# Altium schematic sheet LoadCellAmplifierV2.SchDoc
size A
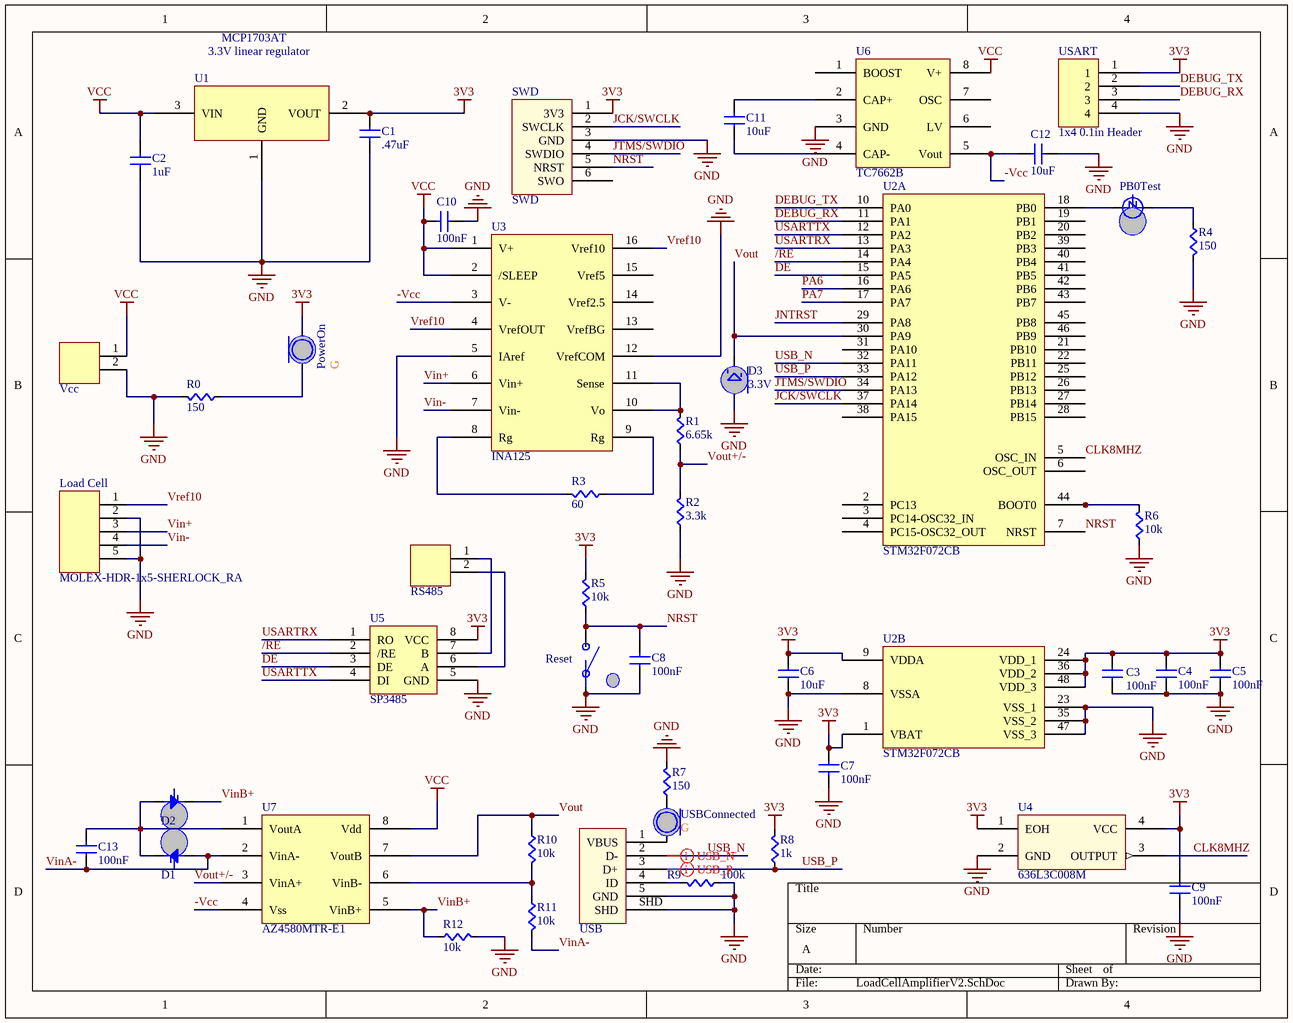
[diagram p0: LoadCellAmplifierV2.SchDoc]

## Parts
C1  value .47uF  [CAPC0603]  (hidden comment: Cap)
C2  value 1uF  [CAPC0603]  (hidden comment: Cap)
C3  value 100nF  [CAPC0603]  (hidden comment: Cap)
C4  value 100nF  [CAPC0603]  (hidden comment: Cap)
C5  value 100nF  [CAPC0603]  (hidden comment: Cap)
C6  value 10uF  [CAPC1206]  (hidden comment: Cap)
C7  value 100nF  [CAPC0603]  (hidden comment: Cap)
C8  value 100nF  [CAPC0603]  (hidden comment: Cap)
C9  value 100nF  [CAPC0603]  (hidden comment: Cap)
C10  value 100nF  [CAPC0603]  (hidden comment: Cap)
C11  value 10uF  [CAPC1206]  (hidden comment: Cap)
C12  value 10uF  [CAPC1206]  (hidden comment: Cap)
C13  value 100nF  [CAPC0603]  (hidden comment: Cap)
D1  Diode  [SOD-323F]  (value not drawn)
D2  Diode  [SOD-323F]  (value not drawn)
D3  Zener Voltage: 3.3V  [LED0603]  (hidden comment: Zener)
Load_Cell  MOLEX-HDR-1x5-SHERLOCK_RA  [MOLEX-HDR-1X5-SHERLOCK- RA]
PB0Test  Color: G  [LED0805]  (hidden comment: LED)
PowerOn  Color: G  [LED0805]  (hidden comment: LED)
R0  value 150  [RES0603]  (hidden comment: Res)
R1  value 6.65k  [RES0603]  (hidden comment: Res)
R2  value 3.3k  [RES0603]  (hidden comment: Res)
R3  value 60  [RES0603]  (hidden comment: Res)
R4  value 150  [RES0603]  (hidden comment: Res)
R5  value 10k  [RES0603]  (hidden comment: Res)
R6  value 10k  [RES0603]  (hidden comment: Res)
R7  value 150  [RES0603]  (hidden comment: Res)
R8  value 1k  [RES0603]  (hidden comment: Res)
R9  value 100k  [RES0603]  (hidden comment: Res)
R10  value 10k  [RES0603]  (hidden comment: Res)
R11  value 10k  [RES0603]  (hidden comment: Res)
R12  value 10k  [RES0603]  (hidden comment: Res)
Reset  Button  [PTS645xxxxSMTR92]  (value not drawn)
RS485  2-pin Horz Sherlock  [MOLEX-HDR-1X2-SHERLOCK-HORZ]  (value not drawn)
SWD  SWD  [SWD_STM32]
U1  MCP1703AT  [MCP1703AT-xx02EDB]
U2  STM32F072CB  [STM32F072CB]  (parts A,B of 2)
U3  INA125  [SOIC127P600X175-16N]
U4  636L3C008M  [636L3C]
U5  SP3485  [SP3485]
U6  TC7662B  [8-SOIC]
U7  AZ4580MTR-E1  [8-SOIC]
USART  1x4 0.1in Header  [1x4 0.1in Header]
USB  USB Micro  [10118192-0001LF]  (value not drawn)
USBConnected  Color: G  [LED0805]  (hidden comment: LED)
Vcc  2-pin Horz Sherlock  [MOLEX-HDR-1X2-SHERLOCK-HORZ]  (value not drawn)

## Nets
3V3: C1.1(A) C3.1(A) C4.1(A) C5.1(A) C6.2(B) C7.1(A) C9.1(A) PowerOn.A R5.1(A) R8.1(A) SWD.1(3V3) U1.2(VOUT) U2.1(VBAT) U2.9(VDDA) U2.24(VDD_1) U2.36(VDD_2) U2.48(VDD_3) U4.1(EOH) U4.4(VCC) U5.8(VCC) USART.1
GND: C1.2(B) C2.2(B) C3.2(B) C4.2(B) C5.2(B) C6.1(A) C7.2(B) C8.2(B) C9.2(B) C10.1(A) C12.1(A) D3.A Load_Cell.2 Load_Cell.5 R0.1(A) R2.2(B) R4.1(A) R6.2(B) R7.1(A) R9.2(B) R12.1(A) Reset.A SWD.3(GND) U1.1(GND) U2.8(VSSA) U2.23(VSS_1) U2.35(VSS_2) U2.47(VSS_3) U3.5(IAref) U3.12(VrefCOM) U4.2(GND) U5.5(GND) U6.3(GND) USART.4 USB.5(GND) USB.SHD Vcc.2
VCC: C2.1(A) C10.2(B) U1.3(VIN) U3.1(V+) U3.2(/SLEEP) U6.8(V+) U7.8(Vdd) Vcc.1
-Vcc: C12.2(B) U3.3(V-) U6.5(Vout) U7.4(Vss)
/RE: U2.14(PA4) U5.2(/RE)
CLK8MHZ: U2.5(OSC_IN) U4.3(OUTPUT)
DE: U2.15(PA5) U5.3(DE)
DEBUG_RX: U2.11(PA1) USART.3
DEBUG_TX: U2.10(PA0) USART.2
JCK/SWCLK: SWD.2(SWCLK) U2.37(PA14)
JNTRST: U2.29(PA8)
JTMS/SWDIO: SWD.4(SWDIO) U2.34(PA13)
NRST: C8.1(A) R5.2(B) Reset.B SWD.5(NRST) U2.7(NRST)
PA6: U2.16(PA6)
PA7: U2.17(PA7)
USARTRX: U2.13(PA3) U5.1(RO)
USARTTX: U2.12(PA2) U5.4(DI)
USB_N: U2.32(PA11) USB.2(D-)
USB_P: R8.2(B) U2.33(PA12) USB.3(D+)
Vin+: Load_Cell.3 U3.6(Vin+)
Vin-: Load_Cell.4 U3.7(Vin-)
VinA-: C13.2(B) D1.A R11.1(A) U7.2(VinA-)
VinB+: D2.C R12.2(B) U7.5(VinB+)
Vout: D3.C R10.2(B) U2.30(PA9) U7.7(VoutB)
Vout+/-: R1.2(B) R2.1(A) U7.3(VinA+)
Vref10: Load_Cell.1 U3.4(VrefOUT) U3.16(Vref10)
NetC11_1: C11.1(A) U6.4(CAP-)
NetC11_2: C11.2(B) U6.2(CAP+)
NetC13_1: C13.1(A) D1.C D2.A U7.1(VoutA)
NetPB0Test_A: PB0Test.A U2.18(PB0)
NetPB0Test_C: PB0Test.C R4.2(B)
NetPowerOn_C: PowerOn.C R0.2(B)
NetR1_1: R1.1(A) U3.10(Vo) U3.11(Sense)
NetR3_1: R3.1(A) U3.8(Rg)
NetR3_2: R3.2(B) U3.9(Rg)
NetR6_1: R6.1(A) U2.44(BOOT0)
NetR7_2: R7.2(B) USBConnected.C
NetR9_1: R9.1(A) USB.4(ID)
NetR10_1: R10.1(A) R11.2(B) U7.6(VinB-)
NetRS485_1: RS485.1 U5.7(B)
NetRS485_2: RS485.2 U5.6(A)
NetUSB_1: USB.1(VBUS) USBConnected.A

Not connected (* = marked no-connect by the designer): SWD 6(SWO); U2 2(PC13) 3(PC14-OSC32_IN) 4(PC15-OSC32_OUT) 6(OSC_OUT) 19(PB1) 20(PB2) 21(PB10) 22(PB11) 25(PB12) 26(PB13) 27(PB14) 28(PB15) 31(PA10) 38(PA15) 39(PB3) 40(PB4) 41(PB5) 42(PB6) 43(PB7) 45(PB8) 46(PB9); U3 13(VrefBG) 14(Vref2.5) 15(Vref5); U6 1(BOOST) 6(LV) 7(OSC)

## Layout directives
differential pair: USB_N, USB_P

## Notes on the sheet
- 3.3V linear regulator

## Library data of the parts
D1 D2 = Diode: Standard Diode Template; Supplier 1: Digi-Key; Supplier Part Number 1: DB2J20900LCT-ND
D3 = Zener: Zener Diode; Supplier 1: Digi-Key; Supplier Part Number 1: CD0603-Z3V3CT-ND
Load_Cell = MOLEX-HDR-1x5-SHERLOCK_RA: Header, Molex, 2mm Pitch Sherlock Header, Single Row, Vertical, 5 Circuits, Length 3.3mm, 0353620550; Manufacturer Part Number: 0353630560; Supplier Part Number 1: WM18934-ND; Supplier 1: Digikey; Manufacturer: Molex
Reset = Button: SPST Button; Supplier 1: Digi-Key; Supplier Part Number 1: CKN9087CT-ND
RS485 Vcc = MOLEX-HDR-1x2-SHERLOCK_RA: Header, Molex, 2mm Pitch Sherlock Header, Single Row, Horizontal, 2 Circuits, Length 3.3mm,  0353630260; Manufacturer: Molex Inc; Manufacturer Part Number: 0353630260
  RS485: Supplier Part Number: WM18931-ND; Supplier: Digi-Key
  Vcc: Supplier Part Number 1: WM18931-ND; Supplier 1: Digi-Key
SWD = SWD_STM32: SWD connector matching the pinout on STM Discovery Boards
U1 = MCP1703AT: 250 mA, 16V, Low Quiescent Current LDO Regulator; Supplier 1: Digi-Key; Supplier Part Number 1: MCP1703AT-3302E/CBCT-ND
U2 = STM32F072CB: MCU 32BIT 128KB FLASH 48LQFP; Supplier 1: Digi-Key; Supplier Part Number 1: 497-14645-ND
U3 = INA125: Instrumentation Amplifier; Supplier 1: Digi-Key; Supplier Part Number 1: INA125UA-ND
U4 = 636L3C: HCMOS/TTL Clock Oscillator; Supplier 1: Digi-Key; Supplier Part Number 1: CTX1005CT-ND
U5 = SP3485: IC TXRX RS485 HALF DUPLEX 8NSOIC; Supplier 1: Digi-Key; Supplier Part Number 1: 1016-1817-1-ND
U6 = TC7662B: Charge Pump DC to DC Voltage Converter
U7 = AZ4580MTR-E1: IC OPAMP GEN PURP SO-8; Supplier 1: Digi-Key; Supplier Part Number 1: AZ4580MTR-E1DICT-ND
USB = USB Micro: USB Mini B Metal Shield SMT; Supplier 1: Digi-Key; Supplier Part Number 1: 609-4613-1-ND
C1-C13 = Cap: Supplier 1: Digi-Key
  C1: Supplier Part Number 1: 445-7465-1-ND
  C2: Supplier Part Number 1: 1276-1860-1-ND
  C3-C5 C7-C10 C13: Supplier Part Number 1: 1276-1000-1-ND
  C6 C11 C12: Supplier Part Number 1: 1276-2876-1-ND
PB0Test PowerOn USBConnected = LED: Supplier 1: Digi-Key
  PB0Test PowerOn: Supplier Part Number 1: 754-1122-1-ND
  USBConnected: Supplier Part Number 1: 160-1414-1-ND
R0-R12 = Res: Supplier 1: Digi-Key
  R0 R4 R7: Supplier Part Number 1: RNCP0603FTD150RCT-ND
  R1: Supplier Part Number 1: RHM6.65KCLCT-ND
  R2: Supplier Part Number 1: RHM3.30KCFCT-ND
  R3: Supplier Part Number 1: FC0603-50BWTR-ND
  R5 R6 R10-R12: Supplier Part Number 1: RMCF0603JT10K0CT-ND
  R8: Supplier Part Number 1: RMCF0603JT1K00CT-ND
  R9: Supplier Part Number 1: RMCF0603JT100KCT-ND